# Altium schematic sheet Regulator.SchDoc
size A4
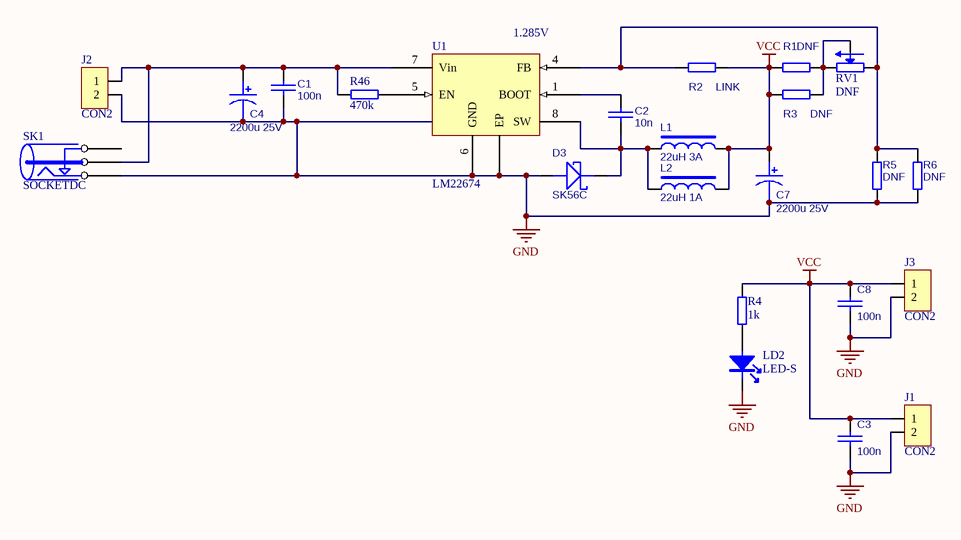
[diagram p0: Regulator.SchDoc]

## Parts
C1  100n  [0603]
C2  10n  [0603]
C3  100n  [0603]
C4  2200u 25V  [RB.2/.5]
C7  2200u 25V  [RB.2/.5]
C8  100n  [0603]
D3  SK56C  [SMC]
J1  CON2  [Terms5mm2]
J2  CON2  [Terms5mm2]
J3  CON2  [Terms5mm2]
L1  22uH 3A  [INDUCTOR3A]
L2  22uH 1A  [INDUCTOR6B]
LD2  LED-S  [0805Diode]
R1  DNF  [0603]
R2  LINK  [0603]
R3  DNF  [0603]
R4  1k  [0603]
R5  DNF  [0603]
R6  DNF  [0603]
R46  470k  [0603]
RV1  DNF  [VR3362P]
SK1  SOCKETDC  [SKTPWR]
U1  LM22674  [PSOP-8]

## Nets
GND: C1.1 C3.2 C4.2 C7.2 C8.2 D3.A J1.2 J2.2 J3.2 LD2.K R5.1 R6.1 SK1.COM U1.6(GND) U1.9(EP)
VCC: C3.1 C7.1 C8.1 J1.1 J3.1 L1.2 L2.2 R1.2 R2.1 R3.2 R4.1
NetC1_2: C1.2 C4.1 J2.1 R46.2 SK1.PIN U1.7(Vin)
NetC2_1: C2.1 U1.1(BOOT)
NetC2_2: C2.2 D3.K L1.1 L2.1 U1.8(SW)
NetLD2_A: LD2.A R4.2
NetR1_1: R1.1 R3.1 RV1.CW RV1.W
NetR2_2: R2.2 R5.2 R6.2 RV1.CCW U1.4(FB)
NetR46_1: R46.1 U1.5(EN)

Not connected (* = marked no-connect by the designer): SK1 SW

## Notes on the sheet
- (near U1) 1.285V

## Library data of the parts
C1-C3 C8 = CAP
C4 C7 = CAPACITOR POL
D3 = DIODE SCHOTTKY
L1 L2 = INDUCTOR2: Part Field 1: Electus LF-1402
LD2 = LED-S: LED
R1-R6 R46 = RES8
RV1 = RES6
SK1 = SOCKETDC: DC Power Connector
U1 = LM22675: 1A SMPS